# Altium project PRT_STM32F429ZI_Eval-Board.PrjPcb (part 1 of 2)
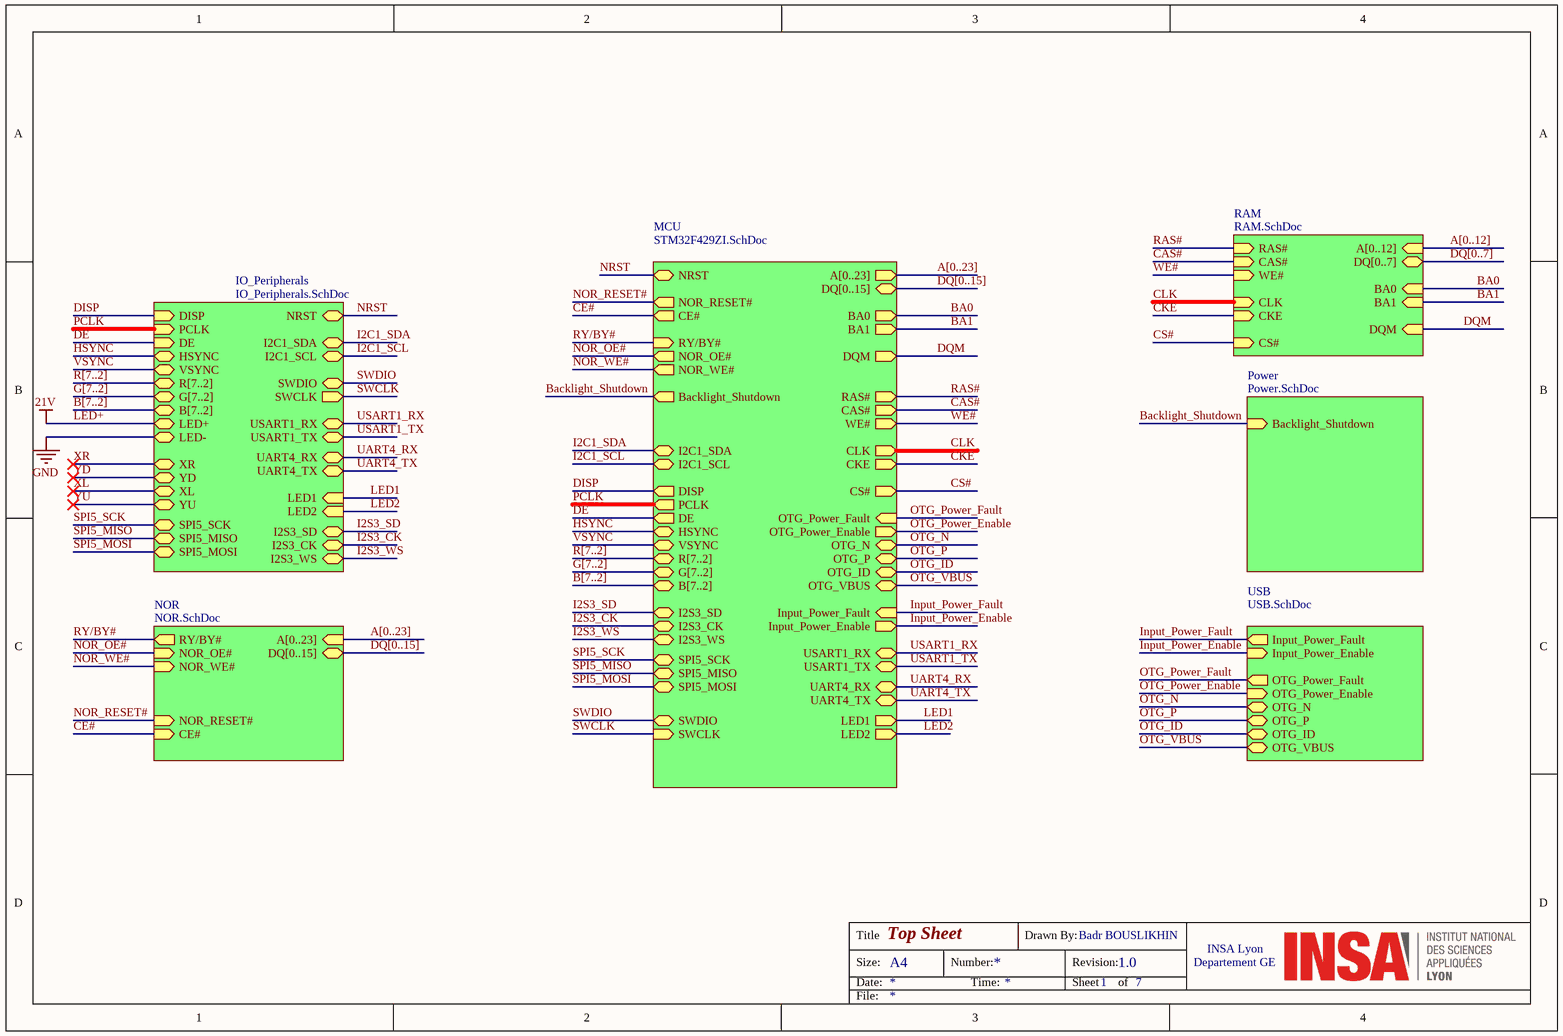
[diagram p0: Top_Sheet.SchDoc]
=SheetTotal: 7
7 sheets, 108 parts. Net scope: hierarchical (ports join the sheet entries above them; power ports are global).
Board file: SB7043.PcbDoc
Sheets:
  Top_Sheet.SchDoc
    MCU = STM32F429ZI.SchDoc
    RAM = RAM.SchDoc
    IO_Peripherals = IO_Peripherals.SchDoc
    Power = Power.SchDoc
    NOR = NOR.SchDoc
    USB = USB.SchDoc

## Sheet Top_Sheet.SchDoc: Top Sheet
size A4; Revision: 1.0; SheetNumber: 1; SheetTotal: 7

### Sub-sheets
IO_Peripherals = IO_Peripherals.SchDoc: NRST (bidir), SWDIO (bidir), SWCLK (out), USART1_TX, USART1_RX, DISP (in), PCLK (in), DE (in), HSYNC, VSYNC, R[7..2], G[7..2], B[7..2], LED+, LED-, XR, YD, XL, YU, LED1 (in), LED2 (in), I2C1_SDA, I2C1_SCL, I2S3_SD, I2S3_CK, I2S3_WS, SPI5_SCK, SPI5_MISO, SPI5_MOSI, UART4_RX, UART4_TX
MCU = STM32F429ZI.SchDoc: NRST (bidir), A[0..23] (out), DQ[0..15] (bidir), BA0 (out), BA1 (out), DQM (out), RAS# (out), CAS# (out), WE# (out), CLK (out), CKE (out), CS# (out), NOR_RESET# (out), CE# (out), RY/BY# (in), NOR_OE# (out), NOR_WE# (out), OTG_Power_Fault (in), OTG_Power_Enable (out), OTG_N (bidir), OTG_P (bidir), OTG_ID (bidir), Input_Power_Enable (out), Input_Power_Fault (in), Backlight_Shutdown (out), OTG_VBUS (bidir), DISP (out), PCLK (out), DE (out), HSYNC, VSYNC, R[7..2], G[7..2], B[7..2], SWDIO (bidir), SWCLK (in), USART1_RX, USART1_TX, LED1 (out), LED2 (out), I2C1_SDA, I2C1_SCL, I2S3_SD, I2S3_CK, I2S3_WS, SPI5_SCK, SPI5_MISO, SPI5_MOSI, UART4_RX, UART4_TX
NOR = NOR.SchDoc: A[0..23] (in), DQ[0..15] (bidir), RY/BY# (out), NOR_OE# (in), NOR_WE# (in), NOR_RESET# (in), CE# (in)
Power = Power.SchDoc: Backlight_Shutdown (in)
RAM = RAM.SchDoc: A[0..12] (in), DQ[0..7] (bidir), RAS# (in), CAS# (in), WE# (in), BA0 (in), BA1 (in), CLK (in), CKE (in), CS# (in), DQM (in)
USB = USB.SchDoc: Input_Power_Fault (out), Input_Power_Enable (in), OTG_Power_Fault (out), OTG_Power_Enable (in), OTG_N, OTG_P, OTG_ID, OTG_VBUS

### Nets
BA0: sheet MCU/BA0, sheet RAM/BA0  [project net A14]
BA1: sheet MCU/BA1, sheet RAM/BA1  [project net A15]
Backlight_Shutdown: sheet MCU/Backlight_Shutdown, sheet Power/Backlight_Shutdown
CAS#: sheet MCU/CAS#, sheet RAM/CAS#
CE#: sheet MCU/CE#, sheet NOR/CE#
CKE: sheet MCU/CKE, sheet RAM/CKE
CLK: sheet MCU/CLK, sheet RAM/CLK
CS#: sheet MCU/CS#, sheet RAM/CS#
DE: sheet MCU/DE, sheet IO_Peripherals/DE
DISP: sheet MCU/DISP, sheet IO_Peripherals/DISP
DQM: sheet MCU/DQM, sheet RAM/DQM
HSYNC: sheet MCU/HSYNC, sheet IO_Peripherals/HSYNC
I2C1_SCL: sheet MCU/I2C1_SCL, sheet IO_Peripherals/I2C1_SCL
I2C1_SDA: sheet MCU/I2C1_SDA, sheet IO_Peripherals/I2C1_SDA
I2S3_CK: sheet MCU/I2S3_CK, sheet IO_Peripherals/I2S3_CK
I2S3_SD: sheet MCU/I2S3_SD, sheet IO_Peripherals/I2S3_SD
I2S3_WS: sheet MCU/I2S3_WS, sheet IO_Peripherals/I2S3_WS
Input_Power_Enable: sheet MCU/Input_Power_Enable, sheet USB/Input_Power_Enable
Input_Power_Fault: sheet MCU/Input_Power_Fault, sheet USB/Input_Power_Fault
LED1: sheet MCU/LED1, sheet IO_Peripherals/LED1
LED2: sheet MCU/LED2, sheet IO_Peripherals/LED2
NOR_OE#: sheet MCU/NOR_OE#, sheet NOR/NOR_OE#
NOR_RESET#: sheet MCU/NOR_RESET#, sheet NOR/NOR_RESET#
NOR_WE#: sheet MCU/NOR_WE#, sheet NOR/NOR_WE#
NRST: sheet MCU/NRST, sheet IO_Peripherals/NRST
OTG_ID: sheet MCU/OTG_ID, sheet USB/OTG_ID
OTG_N: sheet MCU/OTG_N, sheet USB/OTG_N
OTG_P: sheet MCU/OTG_P, sheet USB/OTG_P
OTG_Power_Enable: sheet MCU/OTG_Power_Enable, sheet USB/OTG_Power_Enable
OTG_Power_Fault: sheet MCU/OTG_Power_Fault, sheet USB/OTG_Power_Fault
OTG_VBUS: sheet MCU/OTG_VBUS, sheet USB/OTG_VBUS
PCLK: sheet MCU/PCLK, sheet IO_Peripherals/PCLK
RAS#: sheet MCU/RAS#, sheet RAM/RAS#  [project net PF11]
RY/BY#: sheet MCU/RY/BY#, sheet NOR/RY/BY#
SPI5_MISO: sheet MCU/SPI5_MISO, sheet IO_Peripherals/SPI5_MISO  [project net PF8]
SPI5_MOSI: sheet MCU/SPI5_MOSI, sheet IO_Peripherals/SPI5_MOSI  [project net PF9]
SPI5_SCK: sheet MCU/SPI5_SCK, sheet IO_Peripherals/SPI5_SCK  [project net PF7]
SWCLK: sheet MCU/SWCLK, sheet IO_Peripherals/SWCLK  [project net PA14]
SWDIO: sheet MCU/SWDIO, sheet IO_Peripherals/SWDIO  [project net PA13]
UART4_RX: sheet MCU/UART4_RX, sheet IO_Peripherals/UART4_RX  [project net PA1]
UART4_TX: sheet MCU/UART4_TX, sheet IO_Peripherals/UART4_TX  [project net PA0]
USART1_RX: sheet MCU/USART1_RX, sheet IO_Peripherals/USART1_RX  [project net PA10]
USART1_TX: sheet MCU/USART1_TX, sheet IO_Peripherals/USART1_TX  [project net PA9]
VSYNC: sheet MCU/VSYNC, sheet IO_Peripherals/VSYNC  [project net PA4]
WE#: sheet MCU/WE#, sheet RAM/WE#  [project net PC0]

### Buses and harness runs
bus A[0..12] = sheet RAM/A[0..12]
bus A[0..23] = sheet MCU/A[0..23]
bus A[0..23] = sheet NOR/A[0..23]
bus B[7..2] = sheet IO_Peripherals/B[7..2]
bus B[7..2] = sheet MCU/B[7..2]
bus DQ[0..7] = sheet RAM/DQ[0..7]
bus DQ[0..15] = sheet MCU/DQ[0..15]
bus DQ[0..15] = sheet NOR/DQ[0..15]
bus G[7..2] = sheet IO_Peripherals/G[7..2]
bus G[7..2] = sheet MCU/G[7..2]
bus R[7..2] = sheet IO_Peripherals/R[7..2]
bus R[7..2] = sheet MCU/R[7..2]

### Notes on the sheet
- Title
- Size:
- Date:
- A4
- Number:
- Time:
- Drawn By:
- Revision:
- Sheet
- Badr BOUSLIKHIN
- of
- Departement GE
- INSA Lyon
- File:

## Sheet STM32F429ZI.SchDoc: STM32F429ZI
size A3; Revision: 1.0; SheetNumber: 3; SheetTotal: 7
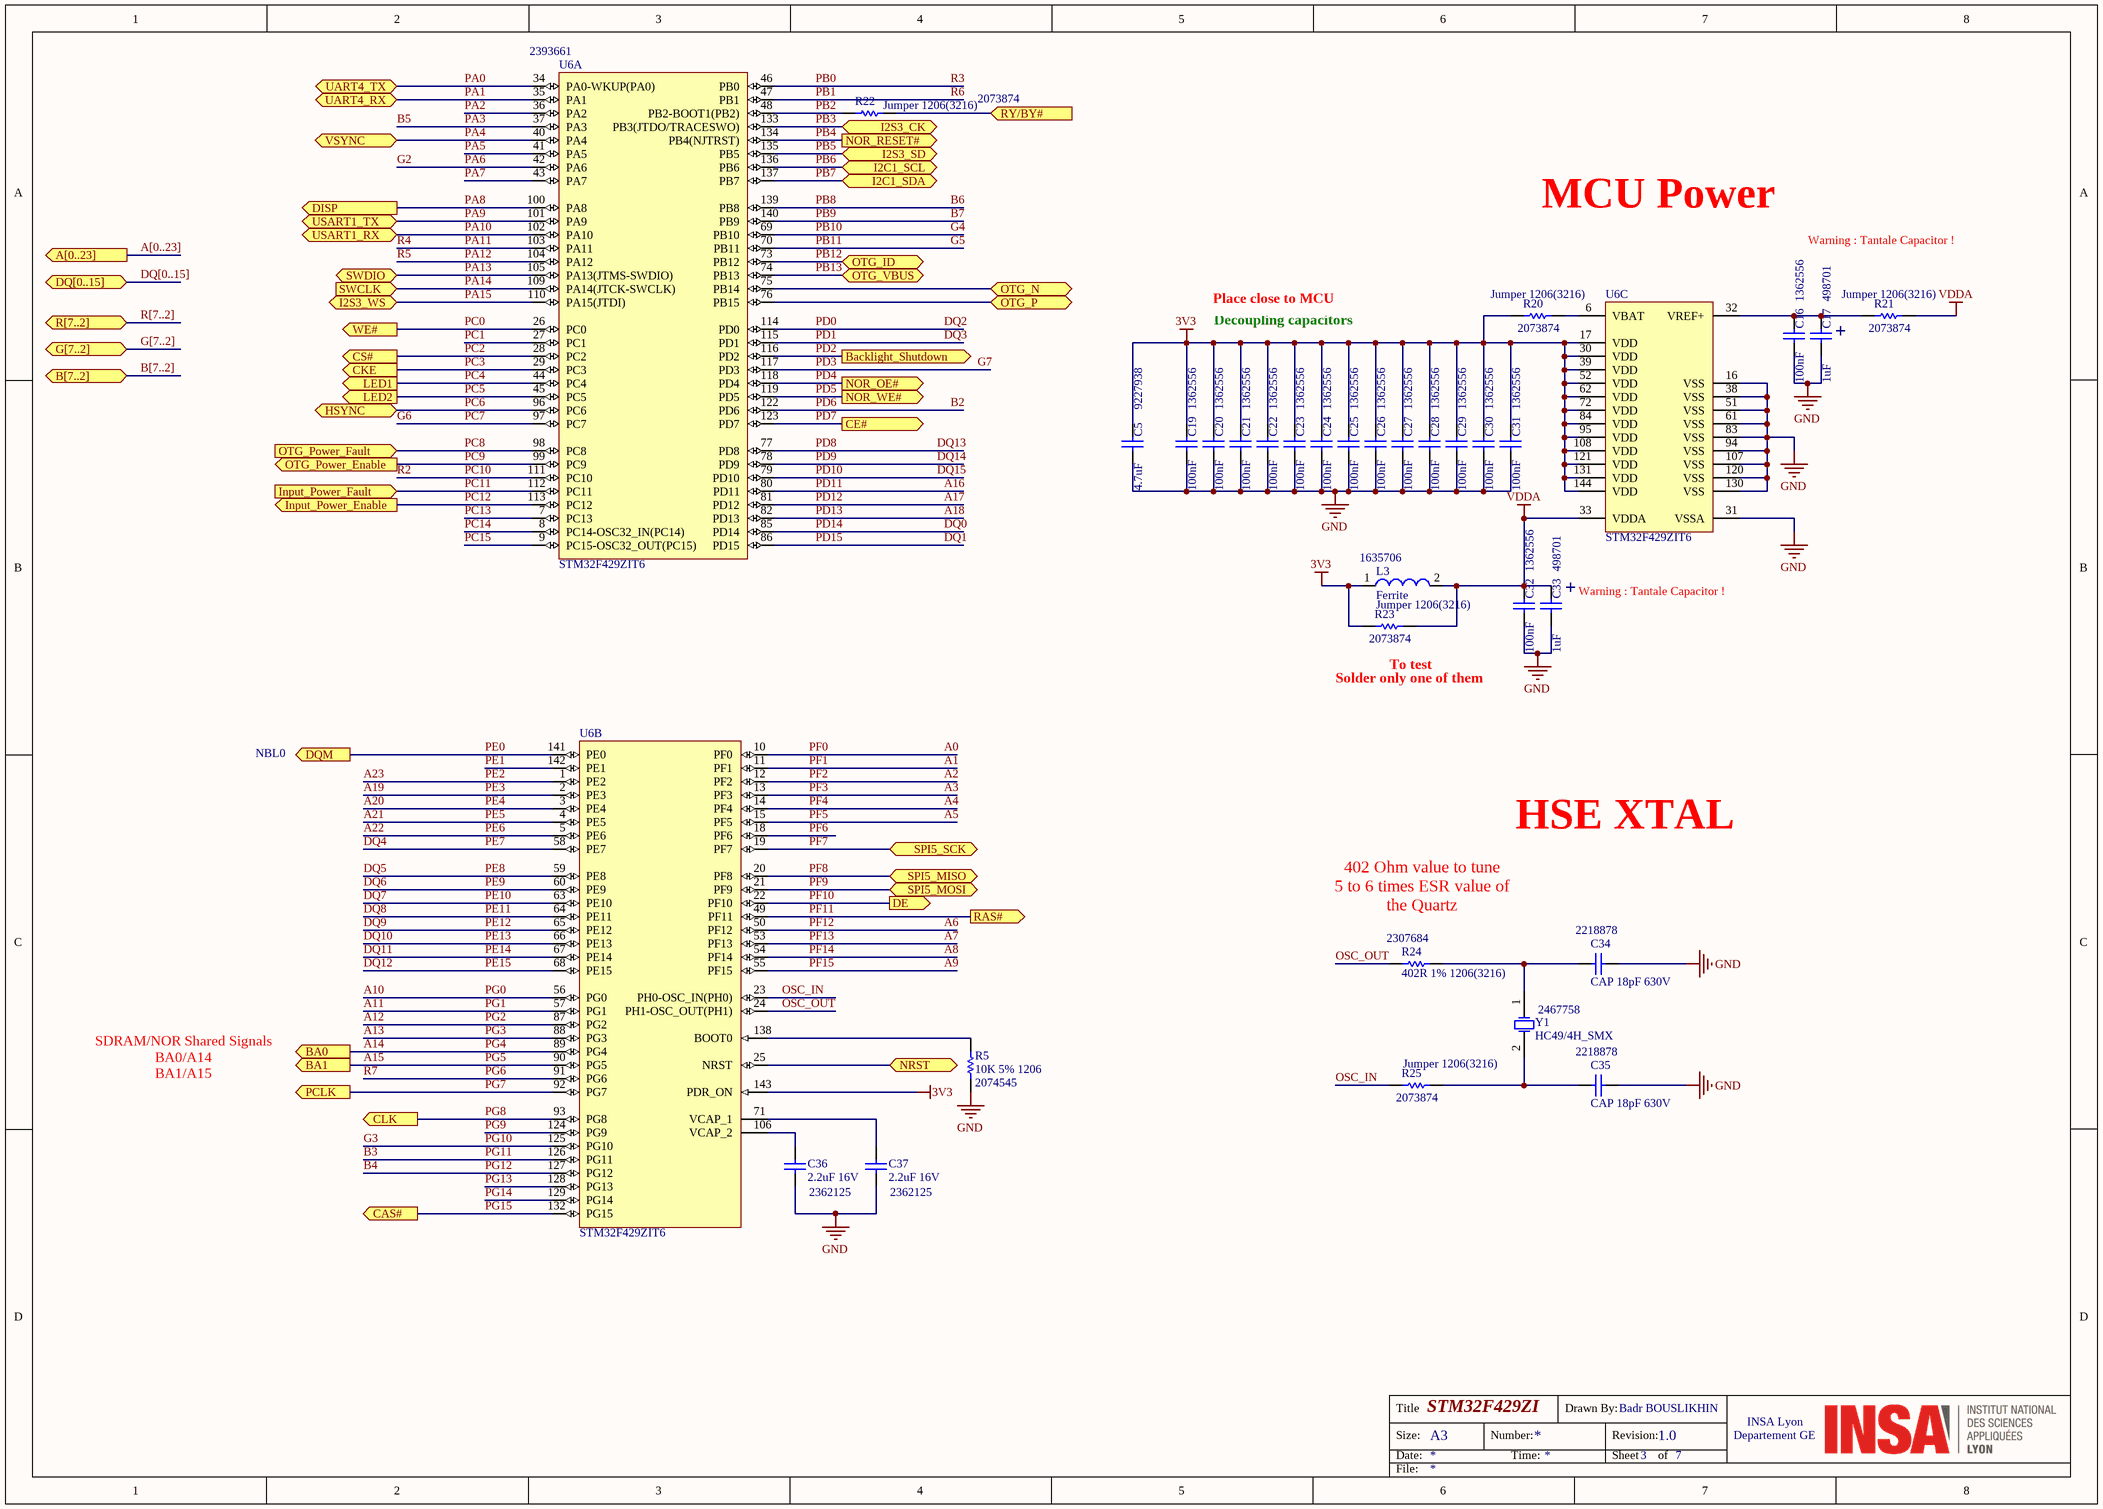
[diagram p1: STM32F429ZI.SchDoc]

### Parts
C5  4.7uF  Supplier Part Number 1: 9227938  [CAPC1206(3216)190_N]
C16  100nF  Supplier Part Number 1: 1362556  [CAPC0603(1608)100_N]
C17  1uF  Supplier Part Number 1: 498701  [CAPC1206(3216)170_L]
C19  100nF  Supplier Part Number 1: 1362556  [CAPC0603(1608)100_N]
C20  100nF  Supplier Part Number 1: 1362556  [CAPC0603(1608)100_N]
C21  100nF  Supplier Part Number 1: 1362556  [CAPC0603(1608)100_N]
C22  100nF  Supplier Part Number 1: 1362556  [CAPC0603(1608)100_N]
C23  100nF  Supplier Part Number 1: 1362556  [CAPC0603(1608)100_N]
C24  100nF  Supplier Part Number 1: 1362556  [CAPC0603(1608)100_N]
C25  100nF  Supplier Part Number 1: 1362556  [CAPC0603(1608)100_N]
C26  100nF  Supplier Part Number 1: 1362556  [CAPC0603(1608)100_N]
C27  100nF  Supplier Part Number 1: 1362556  [CAPC0603(1608)100_N]
C28  100nF  Supplier Part Number 1: 1362556  [CAPC0603(1608)100_N]
C29  100nF  Supplier Part Number 1: 1362556  [CAPC0603(1608)100_N]
C30  100nF  Supplier Part Number 1: 1362556  [CAPC0603(1608)100_N]
C31  100nF  Supplier Part Number 1: 1362556  [CAPC0603(1608)100_N]
C32  100nF  Supplier Part Number 1: 1362556  [CAPC0603(1608)100_N]
C33  1uF  Supplier Part Number 1: 498701  [CAPC1206(3216)170_L]
C34  CAP 18pF 630V  Supplier Part Number 1: 2218878  [CAPC1206(3216)170_L]
C35  CAP 18pF 630V  Supplier Part Number 1: 2218878  [CAPC1206(3216)170_L]
C36  2.2uF 16V  Supplier Part Number 1: 2362125  [CAPC1206(3216)190_L]
C37  2.2uF 16V  Supplier Part Number 1: 2362125  [CAPC1206(3216)190_L]
L3  Ferrite  Supplier Part Number 1: 1635706  [SMD-0603]
R5  10K 5% 1206  Supplier Part Number 1: 2074545  [RESC1206(3216)_M]
R20  Jumper 1206(3216)  Supplier Part Number 1: 2073874  [RESC1206(3216)_L]
R21  Jumper 1206(3216)  Supplier Part Number 1: 2073874  [RESC1206(3216)_L]
R22  Jumper 1206(3216)  Supplier Part Number 1: 2073874  [RESC1206(3216)_L]
R23  Jumper 1206(3216)  Supplier Part Number 1: 2073874  [RESC1206(3216)_L]
R24  402R 1% 1206(3216)  Supplier Part Number 1: 2307684  [RESC1206(3216)_L]
R25  Jumper 1206(3216)  Supplier Part Number 1: 2073874  [RESC1206(3216)_L]
U6  STM32F429ZIT6  Supplier Part Number 1: 2393661  [STM-LQFP144_L]  (parts A,B,C of 3)
Y1  HC49/4H_SMX  Supplier Part Number 1: 2467758  [HC49/4H_SMX]

### Ports
A[0..23] (out), B[7..2], BA0 (out), BA1 (out), Backlight_Shutdown (out), CAS# (out), CE# (out), CKE (out), CLK (out), CS# (out), DE (out), DISP (out), DQ[0..15] (bidir), DQM (out), G[7..2], HSYNC, I2C1_SCL, I2C1_SDA, I2S3_CK, I2S3_SD, I2S3_WS, Input_Power_Enable (out), Input_Power_Fault (in), LED1 (out), LED2 (out), NOR_OE# (out), NOR_RESET# (out), NOR_WE# (out), NRST (bidir), OTG_ID (bidir), OTG_N (bidir), OTG_P (bidir), OTG_Power_Enable (out), OTG_Power_Fault (in), OTG_VBUS (bidir), PCLK (out), R[7..2], RAS# (out), RY/BY# (in), SPI5_MISO, SPI5_MOSI, SPI5_SCK, SWCLK (in), SWDIO (bidir), UART4_RX, UART4_TX, USART1_RX, USART1_TX, VSYNC, WE# (out)

### Nets
3V3: C5.2 C19.2 C20.2 C21.2 C22.2 C23.2 C24.2 C25.2 C26.2 C27.2 C28.2 C29.2 C30.2 C31.2 L3.1 R20.1 R23.1 U6.17(VDD) U6.30(VDD) U6.39(VDD) U6.52(VDD) U6.62(VDD) U6.72(VDD) U6.84(VDD) U6.95(VDD) U6.108(VDD) U6.121(VDD) U6.131(VDD) U6.143(PDR_ON) U6.144(VDD)
GND: C5.1 C16.1 C17.1 C19.1 C20.1 C21.1 C22.1 C23.1 C24.1 C25.1 C26.1 C27.1 C28.1 C29.1 C30.1 C31.1 C32.1 C33.1 C34.2 C35.2 C36.1 C37.1 R5.1 U6.16(VSS) U6.31(VSSA) U6.38(VSS) U6.51(VSS) U6.61(VSS) U6.83(VSS) U6.94(VSS) U6.107(VSS) U6.120(VSS) U6.130(VSS)
VDDA: C32.2 C33.2 L3.2 R21.2 R23.2 U6.33(VDDA)
A0: U6.10(PF0)  [also labelled PF0]
A1: U6.11(PF1)  [also labelled PF1]
A2: U6.12(PF2)  [also labelled PF2]
A3: U6.13(PF3)  [also labelled PF3]
A4: U6.14(PF4)  [also labelled PF4]
A5: U6.15(PF5)  [also labelled PF5]
A6: U6.50(PF12)  [also labelled PF12]
A7: U6.53(PF13)  [also labelled PF13]
A8: U6.54(PF14)  [also labelled PF14]
A9: U6.55(PF15)  [also labelled PF15]
A10: U6.56(PG0)  [also labelled PG0]
A11: U6.57(PG1)  [also labelled PG1]
A12: U6.87(PG2)  [also labelled PG2]
A13: U6.88(PG3)  [also labelled PG3]
A14: U6.89(PG4) ; port BA0  [also labelled PG4]
A15: U6.90(PG5) ; port BA1  [also labelled PG5]
A16: U6.80(PD11)  [also labelled PD11]
A17: U6.81(PD12)  [also labelled PD12]
A18: U6.82(PD13)  [also labelled PD13]
A19: U6.2(PE3)  [also labelled PE3]
A20: U6.3(PE4)  [also labelled PE4]
A21: U6.4(PE5)  [also labelled PE5]
A22: U6.5(PE6)  [also labelled PE6]
A23: U6.1(PE2)  [also labelled PE2]
B2: U6.122(PD6)  [also labelled PD6]
B3: U6.126(PG11)  [also labelled PG11]
B4: U6.127(PG12)  [also labelled PG12]
B5: U6.37(PA3)  [also labelled PA3]
B6: U6.139(PB8)  [also labelled PB8]
B7: U6.140(PB9)  [also labelled PB9]
DQ0: U6.85(PD14)  [also labelled PD14]
DQ1: U6.86(PD15)  [also labelled PD15]
DQ2: U6.114(PD0)  [also labelled PD0]
DQ3: U6.115(PD1)  [also labelled PD1]
DQ4: U6.58(PE7)  [also labelled PE7]
DQ5: U6.59(PE8)  [also labelled PE8]
DQ6: U6.60(PE9)  [also labelled PE9]
DQ7: U6.63(PE10)  [also labelled PE10]
DQ8: U6.64(PE11)  [also labelled PE11]
DQ9: U6.65(PE12)  [also labelled PE12]
DQ10: U6.66(PE13)  [also labelled PE13]
DQ11: U6.67(PE14)  [also labelled PE14]
DQ12: U6.68(PE15)  [also labelled PE15]
DQ13: U6.77(PD8)  [also labelled PD8]
DQ14: U6.78(PD9)  [also labelled PD9]
DQ15: U6.79(PD10)  [also labelled PD10]
G2: U6.42(PA6)  [also labelled PA6]
G3: U6.125(PG10)  [also labelled PG10]
G4: U6.69(PB10)  [also labelled PB10]
G5: U6.70(PB11)  [also labelled PB11]
G6: U6.97(PC7)  [also labelled PC7]
G7: U6.117(PD3)  [also labelled PD3]
NRST: U6.25(NRST) ; port NRST
OSC_IN: R25.1 U6.23(PH0-OSC_IN(PH0))
OSC_OUT: R24.1 U6.24(PH1-OSC_OUT(PH1))
OTG_N: U6.75(PB14) ; port OTG_N
OTG_P: U6.76(PB15) ; port OTG_P
PA0: U6.34(PA0-WKUP(PA0)) ; port UART4_TX
PA1: U6.35(PA1) ; port UART4_RX
PA2: U6.36(PA2)
PA4: U6.40(PA4) ; port VSYNC
PA5: U6.41(PA5)
PA7: U6.43(PA7)
PA8: U6.100(PA8) ; port DISP  [project net DISP]
PA9: U6.101(PA9) ; port USART1_TX
PA10: U6.102(PA10) ; port USART1_RX
PA11: U6.103(PA11)  [also labelled R4]
PA12: U6.104(PA12)  [also labelled R5]
PA13: U6.105(PA13(JTMS-SWDIO)) ; port SWDIO
PA14: U6.109(PA14(JTCK-SWCLK)) ; port SWCLK
PA15: U6.110(PA15(JTDI)) ; port I2S3_WS  [project net I2S3_WS]
PB0: U6.46(PB0)  [also labelled R3]
PB1: U6.47(PB1)  [also labelled R6]
PB2: R22.1 U6.48(PB2-BOOT1(PB2))
PB3: U6.133(PB3(JTDO/TRACESWO)) ; port I2S3_CK  [project net I2S3_CK]
PB4: U6.134(PB4(NJTRST)) ; port NOR_RESET#  [project net NOR_RESET#]
PB5: U6.135(PB5) ; port I2S3_SD  [project net I2S3_SD]
PB6: U6.136(PB6) ; port I2C1_SCL  [project net I2C1_SCL]
PB7: U6.137(PB7) ; port I2C1_SDA  [project net I2C1_SDA]
PB12: U6.73(PB12) ; port OTG_ID  [project net OTG_ID]
PB13: U6.74(PB13) ; port OTG_VBUS  [project net OTG_VBUS]
PC0: U6.26(PC0) ; port WE#
PC1: U6.27(PC1)
PC2: U6.28(PC2) ; port CS#  [project net CS#]
PC3: U6.29(PC3) ; port CKE  [project net CKE]
PC4: U6.44(PC4) ; port LED1  [project net LED1]
PC5: U6.45(PC5) ; port LED2  [project net LED2]
PC6: U6.96(PC6) ; port HSYNC  [project net HSYNC]
PC8: U6.98(PC8) ; port OTG_Power_Fault  [project net OTG_Power_Fault]
PC9: U6.99(PC9) ; port OTG_Power_Enable  [project net OTG_Power_Enable]
PC10: U6.111(PC10)  [also labelled R2]
PC11: U6.112(PC11) ; port Input_Power_Fault  [project net Input_Power_Fault]
PC12: U6.113(PC12) ; port Input_Power_Enable  [project net Input_Power_Enable]
PC13: U6.7(PC13)
PC14: U6.8(PC14-OSC32_IN(PC14))
PC15: U6.9(PC15-OSC32_OUT(PC15))
PD2: U6.116(PD2) ; port Backlight_Shutdown  [project net Backlight_Shutdown]
PD4: U6.118(PD4) ; port NOR_OE#  [project net NOR_OE#]
PD5: U6.119(PD5) ; port NOR_WE#  [project net NOR_WE#]
PD7: U6.123(PD7) ; port CE#  [project net CE#]
PE0: U6.141(PE0) ; port DQM  [project net DQM]
PE1: U6.142(PE1)
PF6: U6.18(PF6)
PF7: U6.19(PF7) ; port SPI5_SCK
PF8: U6.20(PF8) ; port SPI5_MISO
PF9: U6.21(PF9) ; port SPI5_MOSI
PF10: U6.22(PF10) ; port DE  [project net DE]
PF11: U6.49(PF11) ; port RAS#
PG6: U6.91(PG6)  [also labelled R7]
PG7: U6.92(PG7) ; port PCLK  [project net PCLK]
PG8: U6.93(PG8) ; port CLK  [project net CLK]
PG9: U6.124(PG9)
PG13: U6.128(PG13)
PG14: U6.129(PG14)
PG15: U6.132(PG15) ; port CAS#  [project net CAS#]
RY/BY#: R22.2 ; port RY/BY#
NetC16_2: C16.2 C17.2 R21.1 U6.32(VREF+)
NetC34_1: C34.1 R24.2 Y1.1(OSC1)
NetC35_1: C35.1 R25.2 Y1.2(OSC2)
NetC36_2: C36.2 U6.106(VCAP_2)
NetC37_2: C37.2 U6.71(VCAP_1)
NetR5_2: R5.2 U6.138(BOOT0)
NetR20_2: R20.2 U6.6(VBAT)

### Buses and harness runs
bus A[0..23] = port A[0..23]
bus B[7..2] = port B[7..2]
bus DQ[0..15] = port DQ[0..15]
bus G[7..2] = port G[7..2]
bus R[7..2] = port R[7..2]

### Notes on the sheet
- MCU Power
- Warning : Tantale Capacitor !
- Place close to MCU
- Decoupling capacitors
- (near C17) +
- (near C33) +
- (near C33) Warning : Tantale Capacitor !
- Solder only one of them
- (near R23) To test
- NBL0
- HSE XTAL
- (near R24) 402 Ohm value to tune
  5 to 6 times ESR value of the Quartz
- SDRAM/NOR Shared Signals
  BA0/A14
  BA1/A15
- Title
- Size:
- Date:
- A3
- Number:
- Time:
- Drawn By:
- Revision:
- Sheet
- Badr BOUSLIKHIN
- of
- Departement GE
- INSA Lyon
- File:

### Library data of the parts
C5 = CMP-1037-04923-1: CAP 4.7uF 50V ±10% 1206 (3216 Metric) Thickness 1.9mm SMD; Case-EIA: 1206; Case-Metric: 3216; Technology: SMT; Rated Voltage: 50 V; Max Thickness: 1.9 mm; Value: 4.7uF; Tolerance: ±10%; Supplier 1: Farnell
C16 C19-C32 = CMP-1035-02592-1: CAP 100nF 50V ±10% 0603 (1608 Metric) Thickness 1mm SMD; Case-EIA: 0603; Case-Metric: 1608; Technology: SMT; Rated Voltage: 50 V; Max Thickness: 1 mm; Tolerance: ±10%; Value: 100nF; Supplier 1: Farnell
C17 C33 = CMP-1037-04687-1: CAP 1uF 16V ±10% 1206 (3216 Metric) Thickness 1.7mm SMD; Case-EIA: 1206; Case-Metric: 3216; Rated Voltage: 16 V; Max Thickness: 1.7 mm; Technology: SMT; Tolerance: ±10%; Value: 1uF; Supplier 1: Farnell
C34 C35 = CMP-1037-00919-1: CAP 18pF 500V ±5% 1206 (3216 Metric) Thickness 1.7mm SMD; Case-EIA: 1206; Case-Metric: 3216; Rated Voltage: 630 V; Value: 18pF; Tolerance: ±5%; Max Thickness: 1.7 mm; Technology: SMT; Supplier 1: Farnell
C36 C37 = CMP-1037-04816-1: CAP 2.2uF 16V ±20% 1206 (3216 Metric) Thickness 1.9mm SMD; Case-EIA: 1206; Case-Metric: 3216; Max Thickness: 1.9 mm; Rated Voltage: 16 V; Tolerance: ±20%; Technology: SMT; Value: 2.2uF; Supplier 1: Farnell
L3 = CMP-0220-00181-1: SMD EMI Suppression Ferrite Bead WE-CBF, Z = 600 Ohm; Impedance: 600 Ohm; PackageReference: SMD-0603; PackageVersion: 2009; ComponentLink2Description: Datasheet; ComponentLink1Description: Manufacturer Link; ComponentLink2URL: http://www.we-online.de/katalog/media/pdf/742792651.pdf; DatasheetVersion: Dec-2005; ComponentLink1URL: http://www.we-online.com; PackageDescription: Chip Inductor, 2-Leads, Body 1.6 x 0.8 mm; Supplier 1: Farnell
R5 = CMP-1014-00098-1: 10K 0.25W 5% 1206 (3216 Metric)  SMD; Manufacturer: YAGEO (PHYCOMP); Manufacturer Part Number: RC1206JR-0710KL; Value: 10000.00 Ohm; Case-Metric: 3216; Case-EIA: 1206; Power: 0.25 W; Tolerance: 5 %; Technology: SMT; RoHS: YES; ComponentLink1URL: http://www.farnell.com/datasheets/444357.pdf; ComponentLink1Description: http://www.farnell.com/datasheets/444357.pdf; ComponentLink2URL: http://www.farnell.com/cad/1539272.zip; ComponentLink2Description: http://www.farnell.com/cad/1539272.zip; Supplier 1: Farnell
R20-R23 R25 = CMP-1014-00001-1: Jumper 1206 (3216 Metric); Tolerance: None; Case-EIA: 1206; Case-Metric: 3216; Value: 0.00 Ohm; Technology: SMT; Power: None; Supplier 1: Farnell
R24 = CMP-1014-00465-1: 402R 0.25W 1% 1206 (3216 Metric)  SMD; Case-EIA: 1206; Case-Metric: 3216; Value: 402.00 Ohm; Technology: SMT; Power: 0.25 W; Tolerance: 1 %; Supplier 1: Farnell
U6 = CMP-0243-00051-2: ARM Cortex-M4 32-bit MCU+FPU, 225 DMIPS, 2048 kB Flash, 256 kB Internal RAM, 114 I/Os, 144-pin LQFP, -40 to 85 degC, Tray; Manufacturer: STMicroelectronics; I/Os (High Current): 114; Supply Voltage(Vcc) min (V): 1.8; Internal RAM Size (kB): 256; Supply Voltage(Vcc) max (V): 3.6; Operating Frequency(F) (Processor speed) (MHz): 180; D/A Converter: 2x12-bit; FLASH Size (Prog) (kB): 2048; DatasheetVersion: Rev. 2; PackageReference: LQFP144; ComponentLink2URL: http://www.st.com/st-web-ui/static/active/en/resource/technical/document/data_brief/DM00053488.pdf; PartNumber: STM32F429ZIT6; PackageVersion: Rev. 4, 06/2013; ComponentLink3URL: http://www.st.com/st-web-ui/static/active/en/resource/technical/document/datasheet/DM00037051.pdf; Packing: Tray; Mounting Technology: Surface Mount; ComponentLink3Description: Package Specification; ComponentLink1Description: Manufacturer URL; Core: ARM Cortex-M4; ComponentLink1URL: http://www.st.com/web/en/home.html; ComponentLink2Description: Datasheet; PackageDescription: 144-Pin Low Profile Quad Flat Package, 20 x 20 mm Body, 0.5 mm Pitch; PartId: 1; Supplier 1: Farnell
Y1 = HC49/4H_SMX: Surface Mount Quartz Crystal; Note: PCB layout complies with manufacturer's recommendation.; Published: 17-Jul-2002; DatasheetDocument: 18-Oct-1999; PackageDocument: 18-Oct-1999; PackageReference: HC49/4H_SMX; Publisher: Altium Limited; ComponentLink1Description: Manufacturer Link; ComponentLink1URL: http://www.cmac.com/mt/; ComponentLink2Description: Datasheet; ComponentLink2URL: http://www.cmac.com/mt/databook/crystals/smd/hc49_4h_smx.pdf; Supplier 1: Farnell

## Sheet RAM.SchDoc: RAM
size A4; Revision: 1.0; SheetNumber: 4; SheetTotal: 7
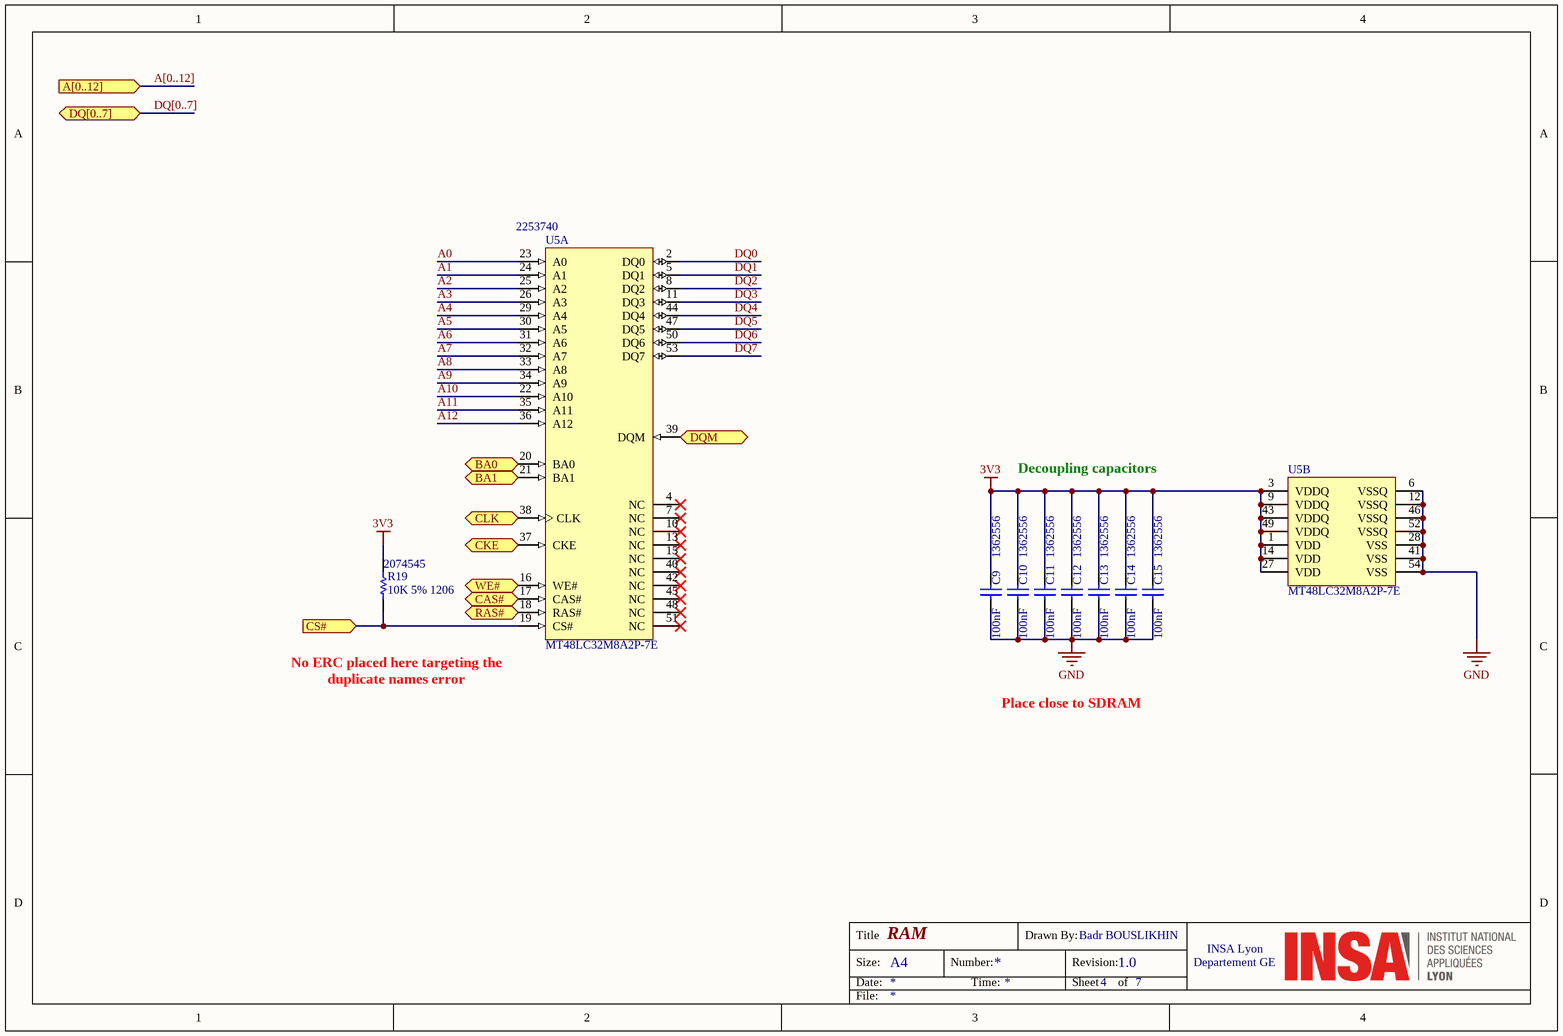
[diagram p2: RAM.SchDoc]

### Parts
C9  100nF  Supplier Part Number 1: 1362556  [CAPC0603(1608)100_N]
C10  100nF  Supplier Part Number 1: 1362556  [CAPC0603(1608)100_N]
C11  100nF  Supplier Part Number 1: 1362556  [CAPC0603(1608)100_N]
C12  100nF  Supplier Part Number 1: 1362556  [CAPC0603(1608)100_N]
C13  100nF  Supplier Part Number 1: 1362556  [CAPC0603(1608)100_N]
C14  100nF  Supplier Part Number 1: 1362556  [CAPC0603(1608)100_N]
C15  100nF  Supplier Part Number 1: 1362556  [CAPC0603(1608)100_N]
R19  10K 5% 1206  Supplier Part Number 1: 2074545  [RESC1206(3216)_M]
U5  MT48LC32M8A2P-7E  Supplier Part Number 1: 2253740  [MICT-P-54_N]  (parts A,B of 2)

### Ports
A[0..12] (in), BA0 (in), BA1 (in), CAS# (in), CKE (in), CLK (in), CS# (in), DQ[0..7] (bidir), DQM (in), RAS# (in), WE# (in)

### Nets
3V3: C9.2 C10.2 C11.2 C12.2 C13.2 C14.2 C15.2 R19.2 U5.1(VDD) U5.3(VDDQ) U5.9(VDDQ) U5.14(VDD) U5.27(VDD) U5.43(VDDQ) U5.49(VDDQ)
GND: C9.1 C10.1 C11.1 C12.1 C13.1 C14.1 C15.1 U5.6(VSSQ) U5.12(VSSQ) U5.28(VSS) U5.41(VSS) U5.46(VSSQ) U5.52(VSSQ) U5.54(VSS)
A0: U5.23(A0)
A1: U5.24(A1)
A2: U5.25(A2)
A3: U5.26(A3)
A4: U5.29(A4)
A5: U5.30(A5)
A6: U5.31(A6)
A7: U5.32(A7)
A8: U5.33(A8)
A9: U5.34(A9)
A10: U5.22(A10)
A11: U5.35(A11)
A12: U5.36(A12)
A14: U5.20(BA0) ; port BA0
A15: U5.21(BA1) ; port BA1
CAS#: U5.17(CAS#) ; port CAS#
CKE: U5.37(CKE) ; port CKE
CLK: U5.38(CLK) ; port CLK
CS#: R19.1 U5.19(CS#) ; port CS#
DQ0: U5.2(DQ0)
DQ1: U5.5(DQ1)
DQ2: U5.8(DQ2)
DQ3: U5.11(DQ3)
DQ4: U5.44(DQ4)
DQ5: U5.47(DQ5)
DQ6: U5.50(DQ6)
DQ7: U5.53(DQ7)
DQM: U5.39(DQM) ; port DQM
PC0: U5.16(WE#) ; port WE#
PF11: U5.18(RAS#) ; port RAS#

Not connected (* = marked no-connect by the designer): U5 4(NC)* 7(NC)* 10(NC)* 13(NC)* 15(NC)* 40(NC)* 42(NC)* 45(NC)* 48(NC)* 51(NC)*

### Buses and harness runs
bus A[0..12] = port A[0..12]
bus DQ[0..7] = port DQ[0..7]

### Notes on the sheet
- Decoupling capacitors
- No ERC placed here targeting the duplicate names error
- Place close to SDRAM
- Title
- Size:
- Date:
- A4
- Number:
- Time:
- Drawn By:
- Revision:
- Sheet
- Badr BOUSLIKHIN
- of
- Departement GE
- INSA Lyon
- File:

### Library data of the parts
C9-C15 = CMP-1035-02592-1: as C16 on sheet STM32F429ZI; Technology: SMT; Rated Voltage: 50 V; Max Thickness: 1 mm; Tolerance: ±10%; Value: 100nF; Supplier 1: Farnell
R19 = CMP-1014-00098-1: as R5 on sheet STM32F429ZI; Power: 0.25 W; Tolerance: 5 %; Technology: SMT; RoHS: YES; ComponentLink1URL: http://www.farnell.com/datasheets/444357.pdf; ComponentLink1Description: http://www.farnell.com/datasheets/444357.pdf; ComponentLink2URL: http://www.farnell.com/cad/1539272.zip; ComponentLink2Description: http://www.farnell.com/cad/1539272.zip; Supplier 1: Farnell
U5 = CMP-0351-00096-1: 256Mb PC133 SDR SDRAM, 32Mb x 8, 7.5ns, 3.3V, 0 to 70 degC, 54-Pin TSOP, Pb-Free; Manufacturer: Micron; Clock Rate: 143 MHz; CL: CL = 2; Op. Temp.: 0C to +70C; Voltage: 3.3V; PackageDescription: 54-Pin Thin Small Outline Package, 10.16 x 22.22 mm, Pitch 0.8 mm; Density: 256Mb; ComponentLink3URL: http://www.micron.com/~/media/Documents/Products/Data%20Sheet/DRAM/128mb_x4x8x16_sdram.pdf; RoHS: Yes; Width: x8; ComponentLink3Description: Package Specification; PartNumber: MT48LC32M8A2P-7E; ComponentLink1Description: Manufacturer URL; PackageReference: MICT-P-54; ComponentLink2URL: http://www.micron.com/~/media/Documents/Products/Data%20Sheet/DRAM/256Mb_sdr.pdf; PackageVersion: Rev.Q; Depth: 32Mb; Data Rate: PC133; Cycle Time: 7.5ns; ComponentLink2Description: Datasheet; Mounting Technology: Surface Mount; ComponentLink1URL: http://www.micron.com/; DatasheetVersion: Rev.Q; PartId: 1; Supplier 1: Farnell

## Sheet IO_Peripherals.SchDoc: IO Peripherals
size A4; Revision: 1.0; SheetNumber: 7; SheetTotal: 7
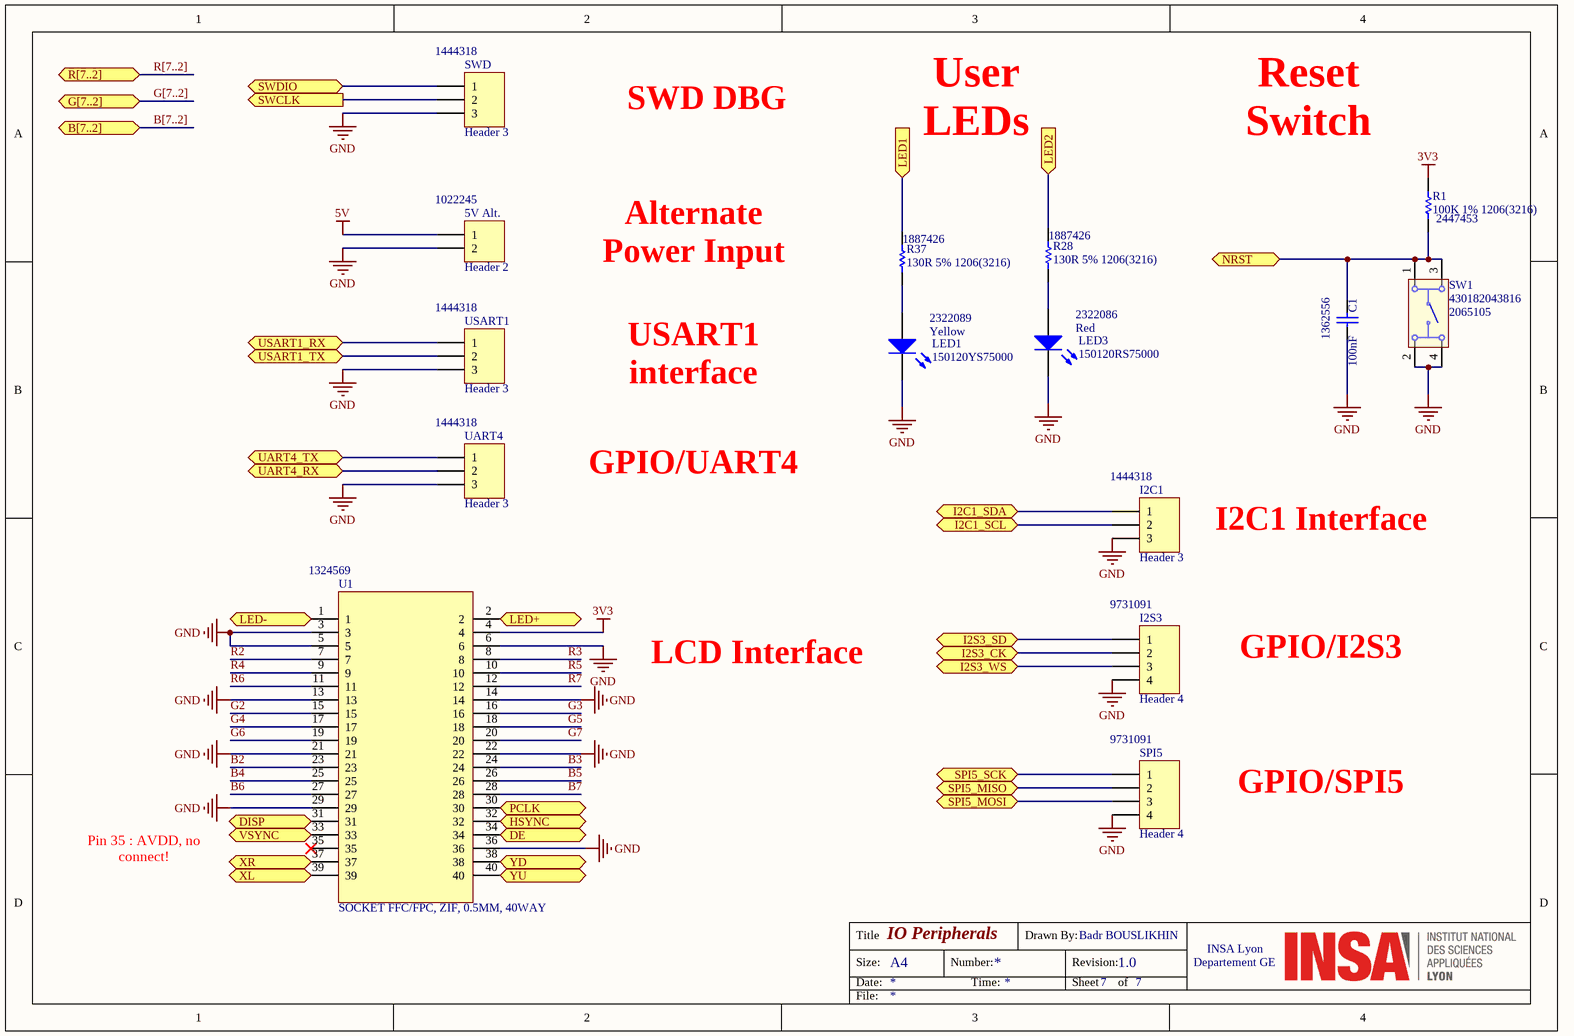
[diagram p3: IO_Peripherals.SchDoc]

### Parts
5V_Alt.  Header 2  Supplier Part Number 1: 1022245  [HDR1X2]
C1  100nF  Supplier Part Number 1: 1362556  [CAPC0603(1608)100_N]
I2C1  Header 3  Supplier Part Number 1: 1444318  [HDR1X3]
I2S3  Header 4  Supplier Part Number 1: 9731091  [HDR1X4]
LED1  150120YS75000  Color: Yellow  Supplier Part Number 1: 2322089  [1206_A]
LED3  150120RS75000  Color: Red  Supplier Part Number 1: 2322086  [1206_A]
R1  100K 1% 1206(3216)  Supplier Part Number 1: 2447453  [RESC1206(3216)_L]
R28  130R 5% 1206(3216)  Supplier Part Number 1: 1887426  [RESC1206(3216)_L]
R37  130R 5% 1206(3216)  Supplier Part Number 1: 1887426  [RESC1206(3216)_L]
SPI5  Header 4  Supplier Part Number 1: 9731091  [HDR1X4]
SW1  430182043816  Supplier Part Number 1: 2065105  [430182043816]
SWD  Header 3  Supplier Part Number 1: 1444318  [HDR1X3]
U1  SOCKET FFC/FPC, ZIF, 0.5MM, 40WAY  Supplier Part Number 1: 1324569  [HIROSE_FH12S-40S-0.5SH(55)]
UART4  Header 3  Supplier Part Number 1: 1444318  [HDR1X3]
USART1  Header 3  Supplier Part Number 1: 1444318  [HDR1X3]

### Ports
B[7..2], DE (in), DISP (in), G[7..2], HSYNC, I2C1_SCL, I2C1_SDA, I2S3_CK, I2S3_SD, I2S3_WS, LED1 (in), LED2 (in), LED+, LED-, NRST (bidir), PCLK (in), R[7..2], SPI5_MISO, SPI5_MOSI, SPI5_SCK, SWCLK (out), SWDIO (bidir), UART4_RX, UART4_TX, USART1_RX, USART1_TX, VSYNC, XL, XR, YD, YU

### Nets
3V3: R1.2 U1.4
5V: 5V_Alt..1
GND: 5V_Alt..2 C1.1 I2C1.3 I2S3.4 LED1.1(K) LED3.1(K) SPI5.4 SW1.2 SW1.4 SWD.3 U1.1 U1.3 U1.5 U1.6 U1.13 U1.14 U1.21 U1.22 U1.29 U1.36 UART4.3 USART1.3 ; port LED-
LED+: U1.2 ; port LED+
B2: U1.23
B3: U1.24
B4: U1.25
B5: U1.26
B6: U1.27
B7: U1.28
DE: U1.34 ; port DE
DISP: U1.31 ; port DISP
G2: U1.15
G3: U1.16
G4: U1.17
G5: U1.18
G6: U1.19
G7: U1.20
HSYNC: U1.32 ; port HSYNC
I2C1_SCL: I2C1.2 ; port I2C1_SCL
I2C1_SDA: I2C1.1 ; port I2C1_SDA
I2S3_CK: I2S3.2 ; port I2S3_CK
I2S3_SD: I2S3.1 ; port I2S3_SD
I2S3_WS: I2S3.3 ; port I2S3_WS
LED1: R37.2 ; port LED1
LED2: R28.2 ; port LED2
NRST: C1.2 R1.1 SW1.1 SW1.3 ; port NRST
PA0: UART4.1 ; port UART4_TX
PA1: UART4.2 ; port UART4_RX
PA4: U1.33 ; port VSYNC
PA9: USART1.2 ; port USART1_TX
PA10: USART1.1 ; port USART1_RX
PA13: SWD.1 ; port SWDIO
PA14: SWD.2 ; port SWCLK
PCLK: U1.30 ; port PCLK
PF7: SPI5.1 ; port SPI5_SCK
PF8: SPI5.2 ; port SPI5_MISO
PF9: SPI5.3 ; port SPI5_MOSI
R2: U1.7  [project net PC10]
R3: U1.8  [project net PB0]
R4: U1.9  [project net PA11]
R5: U1.10  [project net PA12]
R6: U1.11  [project net PB1]
R7: U1.12  [project net PG6]
XL: U1.39 ; port XL
XR: U1.37 ; port XR
YD: U1.38 ; port YD
YU: U1.40 ; port YU
NetLED1_2: LED1.2(A) R37.1
NetLED3_2: LED3.2(A) R28.1

Not connected (* = marked no-connect by the designer): U1 35*

### Buses and harness runs
bus B[7..2] = port B[7..2]
bus G[7..2] = port G[7..2]
bus R[7..2] = port R[7..2]

### Notes on the sheet
- SWD DBG
- User LEDs
- (near R1) Reset Switch
- Alternate Power Input
- USART1 interface
- GPIO/UART4
- I2C1 Interface
- LCD Interface
- GPIO/I2S3
- GPIO/SPI5
- Pin 35 : AVDD, no connect!
- Title
- Size:
- Date:
- A4
- Number:
- Time:
- Drawn By:
- Revision:
- Sheet
- Badr BOUSLIKHIN
- of
- Departement GE
- INSA Lyon
- File:

### Library data of the parts
5V_Alt. = Header 2: Header, 2-Pin; LatestRevisionDate: 17-Jul-2002; LatestRevisionNote: Re-released for DXP Platform.; Publisher: Altium Limited; Supplier 1: Farnell
C1 = CMP-1035-02592-1: as C16 on sheet STM32F429ZI; Technology: SMT; Rated Voltage: 50 V; Max Thickness: 1 mm; Tolerance: ±10%; Value: 100nF; Supplier 1: Farnell
I2C1 SWD UART4 USART1 = Header 3: Header, 3-Pin; LatestRevisionDate: 17-Jul-2002; LatestRevisionNote: Re-released for DXP Platform.; Publisher: Altium Limited; Supplier 1: Farnell
I2S3 SPI5 = Header 4: Header, 4-Pin; LatestRevisionDate: 17-Jul-2002; LatestRevisionNote: Re-released for DXP Platform.; Publisher: Altium Limited; Supplier 1: Farnell
LED1 = CMP-1426-00019-1: SMD mono-color Chip LED, WL-SMCW, Yellow; Manufacturer: Wuerth Elektronik; PackageReference: 1206_A; PartNumber: 150120YS75000; ComponentLink1Description: Manufacturer URL; ComponentLink2URL: http://katalog.we-online.com/led/datasheet/150120YS75000.pdf; ComponentLink2Description: Datasheet; ComponentLink1URL: http://www.we-online.com; Supplier 1: Farnell
LED3 = CMP-1426-00013-1: SMD mono-color Chip LED, WL-SMCW, Red; Manufacturer: Wuerth Elektronik; ComponentLink2URL: http://katalog.we-online.com/led/datasheet/150120RS75000.pdf; ComponentLink2Description: Datasheet; ComponentLink1Description: Manufacturer URL; ComponentLink1URL: http://www.we-online.com; PartNumber: 150120RS75000; PackageReference: 1206_A; Supplier 1: Farnell
R1 = CMP-1014-00736-1: 100K 0.25W 1% 1206 (3216 Metric)  SMD; Manufacturer: YAGEO (PHYCOMP); Manufacturer Part Number: RC1206FR-07100KL; Case-EIA: 1206; Value: 100000.00 Ohm; Case-Metric: 3216; Tolerance: 1 %; Power: 0.25 W; Technology: SMT; RoHS: YES; ComponentLink1URL: http://www.farnell.com/datasheets/444357.pdf; ComponentLink1Description: http://www.farnell.com/datasheets/444357.pdf; Supplier 1: Farnell
R28 R37 = CMP-1014-00053-1: 130R 0.25W 5% 1206 (3216 Metric)  SMD; Case-Metric: 3216; Value: 130.00 Ohm; Case-EIA: 1206; Tolerance: 5 %; Technology: SMT; Power: 0.25 W; Supplier 1: Farnell
SW1 = CMP-1452-00013-1: WS-TASV SMD Tact Switch 6X6 mm; Manufacturer: Wuerth Elektronik; NoPins: 04; ComponentLink2Description: Datasheet; PackageReference: 430182043816; ComponentLink2URL: http://katalog.we-online.de/em/datasheet/4301x2.pdf; ComponentLink1URL: http://www.we-online.com; PartNumber: 430182043816; ComponentLink1Description: Manufacturer URL; Supplier 1: Farnell
U1 = FH12S-40S-0.5SH(55): MPN: FH12S-40S-0.5SH(55); OC_FARNELL: 1324588; OC_NEWARK: 34M6197; PACKAGE: SOCKET FFC/FPC, ZIF, 0.5MM, 40WAY; SUPPLIER: Hirose; Supplier 1: Farnell

## Sheet Power.SchDoc: Power
size A4; DrawnBy: Badr B.; Engineer: Badr B.; Revision: 1.0; SheetNumber: 2; SheetTotal: 7
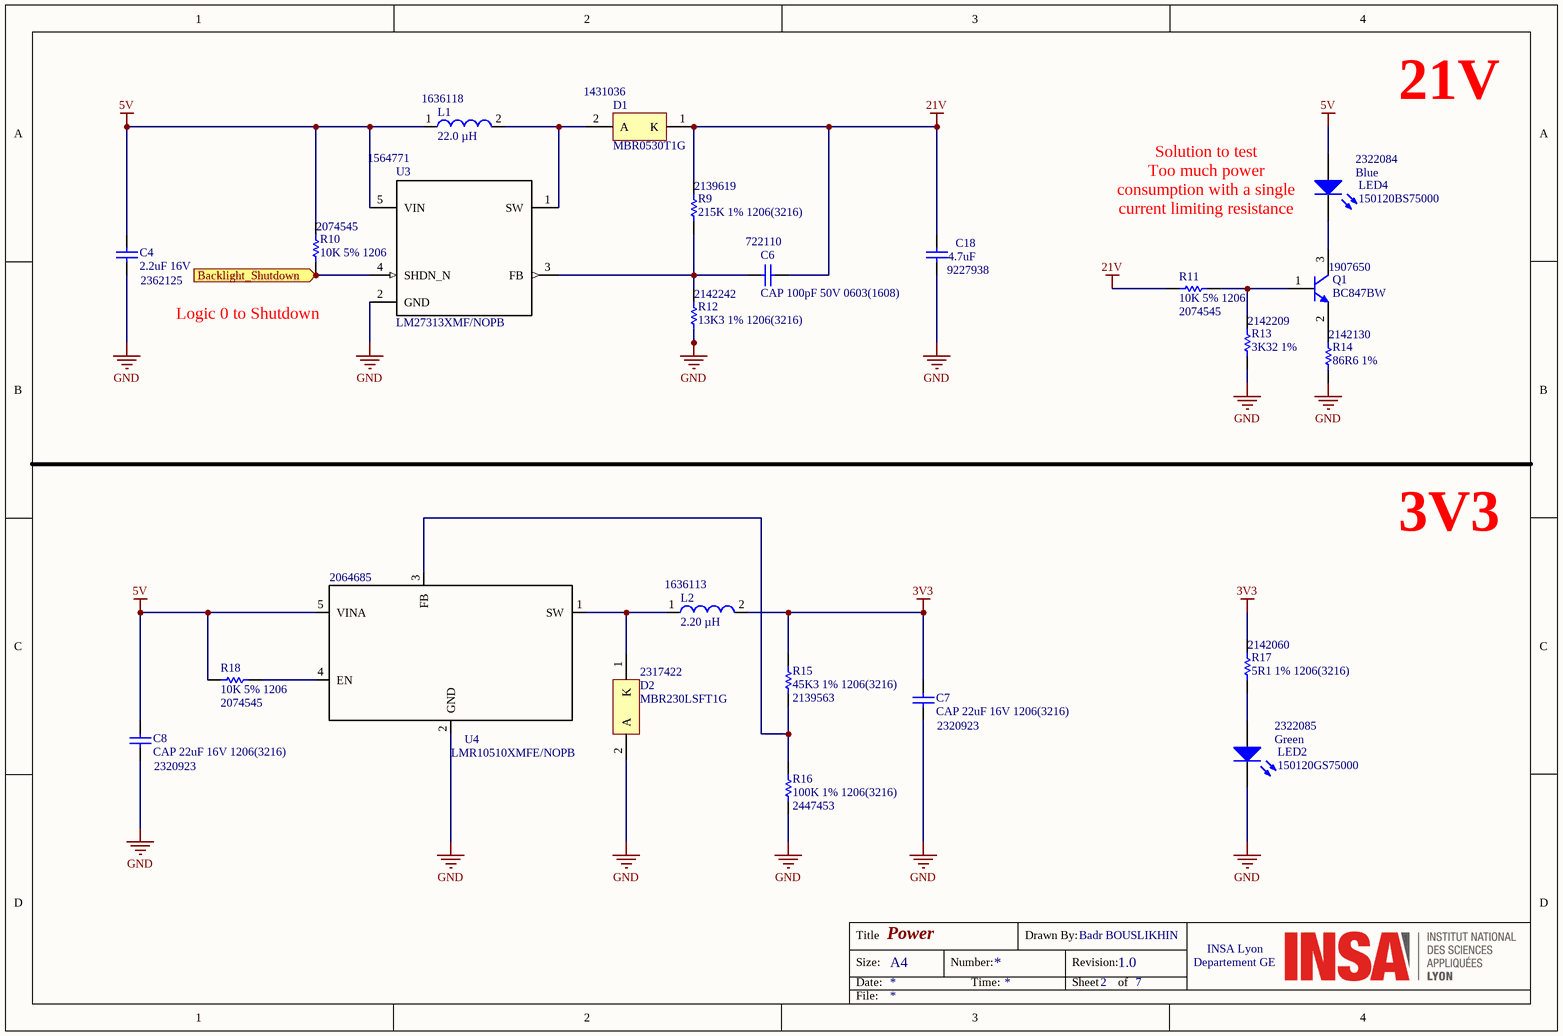
[diagram p4: Power.SchDoc]

### Parts
C4  2.2uF 16V  Supplier Part Number 1: 2362125  [CAPC1206(3216)190_L]
C6  CAP 100pF 50V 0603(1608)  Supplier Part Number 1: 722110  [CAPC0603(1608)100_L]
C7  CAP 22uF 16V 1206(3216)  Supplier Part Number 1: 2320923  [CAPC1206(3216)190_N]
C8  CAP 22uF 16V 1206(3216)  Supplier Part Number 1: 2320923  [CAPC1206(3216)190_N]
C18  4.7uF  Supplier Part Number 1: 9227938  [CAPC1206(3216)190_N]
D1  MBR0530T1G  Supplier Part Number 1: 1431036  [ONSC-SOD-123-2-425-04_V]
D2  MBR230LSFT1G  Supplier Part Number 1: 2317422  [ONSC-SOD-123FL-2-498-01_V]
L1  22.0 µH  Supplier Part Number 1: 1636118  [WE-PD4-S]
L2  2.20 µH  Supplier Part Number 1: 1636113  [WE-PD4-S]
LED2  150120GS75000  Color: Green  Supplier Part Number 1: 2322085  [1206_A]
LED4  150120BS75000  Color: Blue  Supplier Part Number 1: 2322084  [1206_A]
Q1  BC847BW  Supplier Part Number 1: 1907650  [INF-SOT323_N]
R9  215K 1% 1206(3216)  Supplier Part Number 1: 2139619  [RESC1206(3216)_M]
R10  10K 5% 1206  Supplier Part Number 1: 2074545  [RESC1206(3216)_M]
R11  10K 5% 1206  Supplier Part Number 1: 2074545  [RESC1206(3216)_M]
R12  13K3 1% 1206(3216)  Supplier Part Number 1: 2142242  [RESC1206(3216)_L]
R13  3K32 1%  Supplier Part Number 1: 2142209  [RESC1206(3216)_L]
R14  86R6 1%  Supplier Part Number 1: 2142130  [RESC1206(3216)_N]
R15  45K3 1% 1206(3216)  Supplier Part Number 1: 2139563  [RESC1206(3216)_L]
R16  100K 1% 1206(3216)  Supplier Part Number 1: 2447453  [RESC1206(3216)_L]
R17  5R1 1% 1206(3216)  Supplier Part Number 1: 2142060  [RESC1206(3216)_N]
R18  10K 5% 1206  Supplier Part Number 1: 2074545  [RESC1206(3216)_M]
U3  LM27313XMF/NOPB  Supplier Part Number 1: 1564771  [DBV0005A]
U4  LMR10510XMFE/NOPB  Supplier Part Number 1: 2064685  [DBV0005A]

### Ports
Backlight_Shutdown (in)

### Nets
3V3: C7.2 L2.2 R15.1 R17.2
5V: C4.2 C8.2 L1.1 LED4.2(A) R10.2 R18.2 U3.5(VIN) U4.5(VINA)
21V: C6.2 C18.2 D1.1(K) R9.2 R11.2  [project net LED+]
GND: C4.1 C7.1 C8.1 C18.1 D2.2(A) LED2.1(K) R12.1 R13.1 R14.1 R16.1 U3.2(GND) U4.2(GND)
Backlight_Shutdown: R10.1 U3.4(SHDN_N) ; port Backlight_Shutdown
NetC6_1: C6.1 R9.1 R12.2 U3.3(FB)
NetD1_2: D1.2(A) L1.2 U3.1(SW)
NetD2_1: D2.1(K) L2.1 U4.1(SW)
NetLED2_2: LED2.2(A) R17.1
NetLED4_1: LED4.1(K) Q1.3(C)
NetQ1_1: Q1.1(B) R11.1 R13.2
NetQ1_2: Q1.2(E) R14.2
NetR15_2: R15.2 R16.2 U4.3(FB)
NetR18_1: R18.1 U4.4(EN)

### Notes on the sheet
- 21V
- Solution to test
  Too much power consumption with a single current limiting resistance
- Logic 0 to Shutdown
- 3V3
- Title
- Size:
- Date:
- A4
- Number:
- Time:
- Drawn By:
- Revision:
- Sheet
- Badr BOUSLIKHIN
- of
- Departement GE
- INSA Lyon
- File:

### Library data of the parts
C4 = CMP-1037-04816-1: as C36 on sheet STM32F429ZI; Max Thickness: 1.9 mm; Rated Voltage: 16 V; Tolerance: ±20%; Technology: SMT; Value: 2.2uF; Supplier 1: Farnell
C6 = CMP-1035-01270-1: CAP 100pF 50V ±10% 0603 (1608 Metric) Thickness 1mm SMD; Manufacturer: YAGEO (PHYCOMP); Manufacturer Part Number: CC0603KRX7R9BB101; Case-Metric: 1608; Case-EIA: 0603; Technology: SMT; Value: 100pF; Tolerance: ±10%; Max Thickness: 1 mm; Rated Voltage: 50 V; Supplier 1: Farnell; RoHS: YES; Stock 1: 34249; Pricing 1: 10=0,0621, 100=0,0483, 1000=0,0392, 10000=0,0305 (EUR); ComponentLink1URL: http://www.farnell.com/datasheets/1734573.pdf; ComponentLink1Description: http://www.farnell.com/datasheets/1734573.pdf; ComponentLink2URL: http://www.farnell.com/cad/1555016.zip; ComponentLink2Description: http://www.farnell.com/cad/1555016.zip
C7 C8 = CMP-1037-04992-1: CAP 22uF 16V ±10% 1206 (3216 Metric) Thickness 1.9mm SMD; Case-EIA: 1206; Case-Metric: 3216; Rated Voltage: 16 V; Technology: SMT; Value: 22uF; Max Thickness: 1.9 mm; Tolerance: ±10%; Supplier 1: Farnell
C18 = CMP-1037-04923-1: as C5 on sheet STM32F429ZI; Technology: SMT; Rated Voltage: 50 V; Max Thickness: 1.9 mm; Value: 4.7uF; Tolerance: ±10%; Supplier 1: Farnell
D1 = CMP-1055-00413-1: Schottky Power Rectifier, 2-Pin SOD-123, Pb-Free, Tape and Reel; Manufacturer: On Semiconductor; IFSM Max (A): 5.5; Configuration: Single; PackageVersion: Rev. G, 10/2009; ComponentLink2URL: http://www.onsemi.cn/pub_link/Collateral/MBR0530T1-D.PDF; Packing: Tape and Reel; RoHS: TRUE; ComponentLink1URL: http://www.onsemi.com/; Mounting Technology: Surface Mount; ComponentLink3URL: http://www.onsemi.com/pub_link/Collateral/425-04.PDF; ComponentLink3Description: Package Specification; PartNumber: MBR0530T1G; PackageDescription: 2-Pin SOD, Body 1.6 x 2.69 mm; DatasheetVersion: Rev. 7; PackageReference: SOD-123-2-425-04; ComponentLink1Description: Manufacturer URL; ComponentLink2Description: Datasheet; Supplier 1: Farnell
D2 = CMP-1055-00442-1: Schottky Power Rectifier, 2-Pin SOD-123, Pb-Free, Tape and Reel; Manufacturer: On Semiconductor; Configuration: Single; IFSM Max (A): 40; ComponentLink2Description: Datasheet; DatasheetVersion: Rev. 0; ComponentLink1URL: http://www.onsemi.com/; ComponentLink2URL: http://www.onsemi.cn/pub_link/Collateral/MBR230LSFT1G.PDF; ComponentLink3Description: Package Specification; PackageDescription: 2-Pin SOD, Body 1.65 x 2.7 mm; RoHS: TRUE; PackageVersion: Rev. A; Mounting Technology: Surface Mount; ComponentLink3URL: http://www.onsemi.cn/pub_link/Collateral/MBR120VLSFT1-D.PDF; ComponentLink1Description: Manufacturer URL; Packing: Tape and Reel; PackageReference: SOD-123FL-2-498-01; PartNumber: MBR230LSFT1G; Supplier 1: Farnell
L1 = CMP-0227-00739-1: SMD-Power Inductor WE-PD4, L = 22.0 µH; ComponentLink2Description: Datasheet; ComponentLink2URL: http://www.we-online.de/katalog/media/pdf/74455122.pdf; ComponentLink1URL: http://www.we-online.com; Inductance: 22.0 µH; PackageReference: WE-PD4-S; DatasheetVersion: ver 2, Feb-2009; PackageVersion: 2009; PackageDescription: SMD Inductor, 2-Leads, Body 6.6 x 4.45 mm; ComponentLink1Description: Manufacturer Link; Supplier 1: Farnell
L2 = CMP-0227-00671-1: SMD-Power Inductor WE-PD4, L = 2.20 µH; Manufacturer: WURTH ELEKTRONIK; Manufacturer Part Number: 74455022; Gamme de produit: Série WE-PD4; Tolérance d'Inductance: ± 20%; Construction inductance: Non blindé; Résistance DC max.: 0.07; Courant efficace (Irms): 2.4; Courant de Saturation (Isat): 2.3; Boîtier Inducteur de Puissance: 6.6mm x 4.45mm x 2.92; Type de packaging: Bande découpée; SVHC: No SVHC (17-Dec-2014); Fréquence de résonance: 90; Nombre de broches: 2; Type d'inductance: De puissance<!--FANDB--><div class="features-and-benefits-container"></div>; PackageDescription: SMD Inductor, 2-Leads, Body 6.6 x 4.45 mm; ComponentLink2URL: http://www.we-online.de/katalog/media/pdf/74455022.pdf; PackageReference: WE-PD4-S; ComponentLink1URL: http://www.we-online.com; ComponentLink2Description: Datasheet; Inductance: 2.20 µH; PackageVersion: 2009; ComponentLink1Description: Manufacturer Link; DatasheetVersion: ver 2, Feb-2009; Supplier 1: Farnell; RoHS: YES; Stock 1: 204; Pricing 1: 1=2,16, 10=2,01, 50=1,81, 100=1,73, 300=1,67, 600=1,63 (EUR); Fréquence de résonance: 90; Série: WE-PD4; ComponentLink3URL: http://www.farnell.com/datasheets/1735973.pdf; ComponentLink3Description: http://www.farnell.com/datasheets/1735973.pdf; ComponentLink4URL: http://www.farnell.com/cad/1670112.zip; ComponentLink4Description: http://www.farnell.com/cad/1670112.zip
LED2 = CMP-1426-00014-1: SMD mono-color Chip LED, WL-SMCW, Green; Manufacturer: Wuerth Elektronik; PackageReference: 1206_A; PartNumber: 150120GS75000; ComponentLink1Description: Manufacturer URL; ComponentLink2URL: http://katalog.we-online.com/led/datasheet/150120GS75000.pdf; ComponentLink2Description: Datasheet; ComponentLink1URL: http://www.we-online.com; Supplier 1: Farnell
LED4 = CMP-1426-00015-1: SMD mono-color Chip LED, WL-SMCW, Blue; Manufacturer: Wuerth Elektronik; ComponentLink2Description: Datasheet; ComponentLink1URL: http://www.we-online.com; PartNumber: 150120BS75000; ComponentLink1Description: Manufacturer URL; ComponentLink2URL: http://katalog.we-online.com/led/datasheet/150120BS75000.pdf; PackageReference: 1206_A; Supplier 1: Farnell
Q1 = CMP-1177-00080-1: NPN Silicon AF Transistor, 45 V VCEO, 100 mA IC, SOT323, Reel, Green; Manufacturer: Infineon; VCEO (max): 45 V; ICBO (max): 15 nA; IBM (max): 200 mA; Ptot (max): 250 mW; Green: TRUE; VEBO (max): 6 V; IC (max): 100 mA; VCBO (max): 50 V; fT (typ): 250 MHz; Halogen-free: TRUE; Packing: Reel; Mounting Technology: Surface Mount; PackageReference: SOT323; PartNumber: BC847BW; PackageDescription: 3-Pin Small Outline Transistor Package, 1.25 x 2 mm Body, 0.65 mm Pitch; ICM (max): 200 mA; ComponentLink3Description: Package Specification; ComponentLink1URL: http://www.infineon.com/; ComponentLink2Description: Datasheet; Polarity: NPN; ComponentLink2URL: http://www.infineon.com/dgdl/bc847series_bc848series_bc849series_bc850series.pdf?folderId=db3a304314dca389011541d30fa21656&fileId=db3a304314dca389011541d4630a1657; ComponentLink1Description: Manufacturer URL; ComponentLink3URL: http://www.infineon.com/dgdl/SOT323-Package_Overview.pdf?folderId=db3a30431936bc4b0119533e1dcb3c92&fileId=db3a30431936bc4b011953495f283cb1; Supplier 1: Farnell
R9 = CMP-1014-00771-1: 215K 0.25W 1% 1206 (3216 Metric)  SMD; Manufacturer: VISHAY DRALORIC; Manufacturer Part Number: CRCW1206215KFKEA; Value: 215000.00 Ohm; Case-EIA: 1206; Case-Metric: 3216; Gamme de produit: Série AEC-Q200 CRCW; Résistance: 215; Puissance: 250; Tension: 200; Type de boîtier de résistance: 1206 [3216 Metric]; Type de packaging: Bande découpée; Type de résistance: Couche épaisse; Coefficient de température: ± 100; SVHC: No SVHC (17-Dec-2014); Montage de résistance: CMS<!--FANDB--><div class="features-and-benefits-container"></div>; Tolerance: 1 %; Power: 0.25 W; Technology: SMT; Supplier 1: Farnell; RoHS: Y-EX; Stock 1: 3650; Pricing 1: 50=0,016, 250=0,0127, 500=0,01, 1000=0,0084 (EUR); Tolérance de résistance: ± 1%; MSL: MSL 1 - Illimité; ComponentLink1URL: http://www.farnell.com/datasheets/1697337.pdf; ComponentLink1Description: http://www.farnell.com/datasheets/1697337.pdf
R10 R11 R18 = CMP-1014-00098-1: as R5 on sheet STM32F429ZI; Power: 0.25 W; Tolerance: 5 %; Technology: SMT; RoHS: YES; ComponentLink1URL: http://www.farnell.com/datasheets/444357.pdf; ComponentLink1Description: http://www.farnell.com/datasheets/444357.pdf; ComponentLink2URL: http://www.farnell.com/cad/1539272.zip; ComponentLink2Description: http://www.farnell.com/cad/1539272.zip; Supplier 1: Farnell
R12 = CMP-1014-00636-1: 13K3 0.25W 1% 1206 (3216 Metric)  SMD; Manufacturer: VISHAY DRALORIC; Manufacturer Part Number: CRCW120613K3FKEA; Value: 13300.00 Ohm; Case-Metric: 3216; Case-EIA: 1206; Tolerance: 1 %; Technology: SMT; Power: 0.25 W; RoHS: Y-EX; ComponentLink1URL: http://www.farnell.com/datasheets/1697337.pdf; ComponentLink1Description: http://www.farnell.com/datasheets/1697337.pdf; ComponentLink2URL: http://www.farnell.com/cad/1553262.zip; ComponentLink2Description: http://www.farnell.com/cad/1553262.zip; Supplier 1: Farnell
R13 = CMP-1014-00568-1: 3K32 0.25W 1% 1206 (3216 Metric)  SMD; Case-EIA: 1206; Case-Metric: 3216; Value: 3320.00 Ohm; Tolerance: 1 %; Technology: SMT; Power: 0.25 W; Supplier 1: Farnell
R14 = CMP-1014-00390-1: 86R6 0.25W 1% 1206 (3216 Metric)  SMD; Case-EIA: 1206; Case-Metric: 3216; Value: 86.60 Ohm; Tolerance: 1 %; Technology: SMT; Power: 0.25 W; Supplier 1: Farnell
R15 = CMP-1014-00697-1: 45K3 0.25W 1% 1206 (3216 Metric)  SMD; Manufacturer: VISHAY DRALORIC; Manufacturer Part Number: CRCW120645K3FKEA; Case-EIA: 1206; Case-Metric: 3216; Value: 45300.00 Ohm; Tolerance: 1 %; Technology: SMT; Power: 0.25 W; Supplier 1: Farnell; RoHS: Y-EX; Stock 1: 8000; Pricing 1: 50=0,014, 250=0,0135, 500=0,0099, 1000=0,0084 (EUR); ComponentLink1URL: http://www.farnell.com/datasheets/1697337.pdf; ComponentLink1Description: http://www.farnell.com/datasheets/1697337.pdf
R16 = CMP-1014-00736-1: as R1 on sheet IO_Peripherals; Tolerance: 1 %; Power: 0.25 W; Technology: SMT; RoHS: YES; ComponentLink1URL: http://www.farnell.com/datasheets/444357.pdf; ComponentLink1Description: http://www.farnell.com/datasheets/444357.pdf; Supplier 1: Farnell
R17 = CMP-1014-00251-1: 5R1 0.25W 1% 1206 (3216 Metric)  SMD; Value: 5.10 Ohm; Case-EIA: 1206; Case-Metric: 3216; Tolerance: 1 %; Technology: SMT; Power: 0.25 W; Supplier 1: Farnell
U3 = LM27313XMF/NOPB: Imported; PartNumber: LM27313XQMF/NOPB; Manufacturer: Texas Instruments; CompType: IC; PIN_COUNT: 5; PackageReference: DBV0005A; MountType: SMT; RoHS: Y; Manufacturer_Part_Number: LM27313XMF/NOPB; Manufacturer_Name: Texas Instruments; RefDes: RefDes; Type: DEV; Value: Value; Supplier 1: Farnell
U4 = LMR10510XMFE/NOPB: Imported; Frequency: 3000000.0; Imax: 1.0; Mktg_Package: NA; Vendor: Texas Instruments; Tension, entrée min.: 3; Tension, entrée max..: 5.5; Nombre de canaux de sortie: 1; Boîtier de convertisseur DC / DC: SOT-23; Nombre de broches: 5; Tension, sortie min.: 600; Tension, sortie max..: 4.5; Fréquence de commutation: 1.6; Topologie: Buck (Abaisseur); Température de fonctionnement max..: 125; Type de packaging: Bande découpée; SVHC: No SVHC (17-Dec-2014); Température de fonctionnement: -40°C à +125; Température d'utilisation min: -40; Datasheet URL: http://www.ti.com/product/lmr10510; Package: NA; NSID: LMR10510XMFE/NOPB; Manufacturer_Part_Number: LMR10510XMFE/NOPB; Manufacturer_Name: Texas Instruments; RefDes: RefDes; Type: DEV; Value: Value; Supplier 1: Farnell; Manufacturer: TEXAS INSTRUMENTS; Manufacturer Part Number: LMR10510XMF; RoHS: YES; Stock 1: 917; Pricing 1: 1=1,03, 10=0,692, 100=0,579, 250=0,503, 500=0,455, 1000=0,409, 4000=0,361, 10000=0,324 (EUR); Courant, sortie: 1; MSL: MSL 1 - Illimité; Tension d'entrée primaire: 5.5; Tension, sortie: 4.5; ComponentLink1URL: http://www.farnell.com/simulation/1745330.zip; ComponentLink1Description: http://www.farnell.com/simulation/1745330.zip; ComponentLink2URL: http://www.farnell.com/datasheets/1503732.pdf; ComponentLink2Description: http://www.farnell.com/datasheets/1503732.pdf; ComponentLink3URL: http://www.farnell.com/cad/1757176.zip; ComponentLink3Description: http://www.farnell.com/cad/1757176.zip

## Sheet NOR.SchDoc
size A4
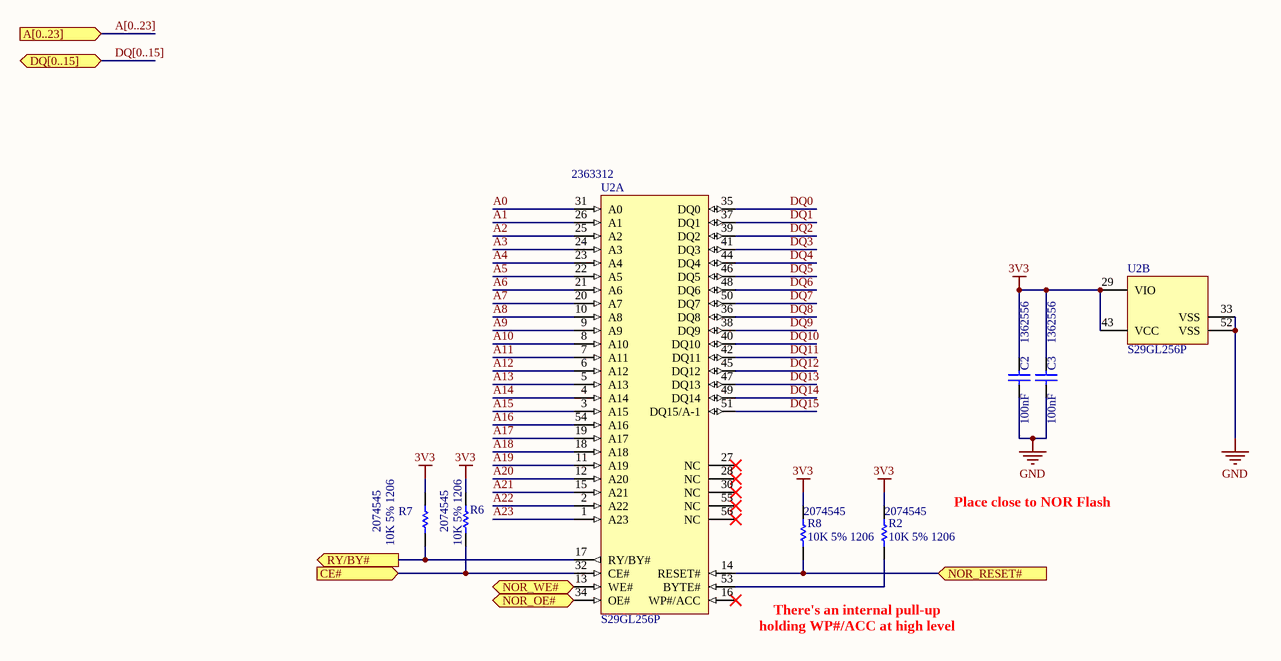
[diagram p5: NOR.SchDoc]

### Parts
C2  100nF  Supplier Part Number 1: 1362556  [CAPC0603(1608)100_N]
C3  100nF  Supplier Part Number 1: 1362556  [CAPC0603(1608)100_N]
R2  10K 5% 1206  Supplier Part Number 1: 2074545  [RESC1206(3216)_M]
R6  10K 5% 1206  Supplier Part Number 1: 2074545  [RESC1206(3216)_M]
R7  10K 5% 1206  Supplier Part Number 1: 2074545  [RESC1206(3216)_M]
R8  10K 5% 1206  Supplier Part Number 1: 2074545  [RESC1206(3216)_M]
U2  S29GL256P  Supplier Part Number 1: 2363312  [56-Pin_Standard_TSOP]  (parts A,B of 2)

### Ports
A[0..23] (in), CE# (in), DQ[0..15] (bidir), NOR_OE# (in), NOR_RESET# (in), NOR_WE# (in), RY/BY# (out)

### Nets
3V3: C2.2 C3.2 R2.2 R6.2 R7.2 R8.2 U2.29(VIO) U2.43(VCC)
GND: C2.1 C3.1 U2.33(VSS) U2.52(VSS)
A0: U2.31(A0)
A1: U2.26(A1)
A2: U2.25(A2)
A3: U2.24(A3)
A4: U2.23(A4)
A5: U2.22(A5)
A6: U2.21(A6)
A7: U2.20(A7)
A8: U2.10(A8)
A9: U2.9(A9)
A10: U2.8(A10)
A11: U2.7(A11)
A12: U2.6(A12)
A13: U2.5(A13)
A14: U2.4(A14)
A15: U2.3(A15)
A16: U2.54(A16)
A17: U2.19(A17)
A18: U2.18(A18)
A19: U2.11(A19)
A20: U2.12(A20)
A21: U2.15(A21)
A22: U2.2(A22)
A23: U2.1(A23)
CE#: R6.1 U2.32(CE#) ; port CE#
DQ0: U2.35(DQ0)
DQ1: U2.37(DQ1)
DQ2: U2.39(DQ2)
DQ3: U2.41(DQ3)
DQ4: U2.44(DQ4)
DQ5: U2.46(DQ5)
DQ6: U2.48(DQ6)
DQ7: U2.50(DQ7)
DQ8: U2.36(DQ8)
DQ9: U2.38(DQ9)
DQ10: U2.40(DQ10)
DQ11: U2.42(DQ11)
DQ12: U2.45(DQ12)
DQ13: U2.47(DQ13)
DQ14: U2.49(DQ14)
DQ15: U2.51(DQ15/A-1)
NOR_OE#: U2.34(OE#) ; port NOR_OE#
NOR_RESET#: R8.1 U2.14(RESET#) ; port NOR_RESET#
NOR_WE#: U2.13(WE#) ; port NOR_WE#
RY/BY#: R7.1 U2.17(RY/BY#) ; port RY/BY#
NetR2_1: R2.1 U2.53(BYTE#)

Not connected (* = marked no-connect by the designer): U2 16(WP#/ACC)* 27(NC)* 28(NC)* 30(NC)* 55(NC)* 56(NC)*

### Buses and harness runs
bus A[0..23] = port A[0..23]
bus DQ[0..15] = port DQ[0..15]

### Notes on the sheet
- (near R2) Place close to NOR Flash
- There's an internal pull-up holding WP#/ACC at high level

### Library data of the parts
C2 C3 = CMP-1035-02592-1: as C16 on sheet STM32F429ZI; Technology: SMT; Rated Voltage: 50 V; Max Thickness: 1 mm; Tolerance: ±10%; Value: 100nF; Supplier 1: Farnell
R2 R6-R8 = CMP-1014-00098-1: as R5 on sheet STM32F429ZI; Power: 0.25 W; Tolerance: 5 %; Technology: SMT; RoHS: YES; ComponentLink1URL: http://www.farnell.com/datasheets/444357.pdf; ComponentLink1Description: http://www.farnell.com/datasheets/444357.pdf; ComponentLink2URL: http://www.farnell.com/cad/1539272.zip; ComponentLink2Description: http://www.farnell.com/cad/1539272.zip; Supplier 1: Farnell
U2 = S29GL256P: Supplier 1: Farnell